# Altium schematic sheet PMU.SchDoc
size A4
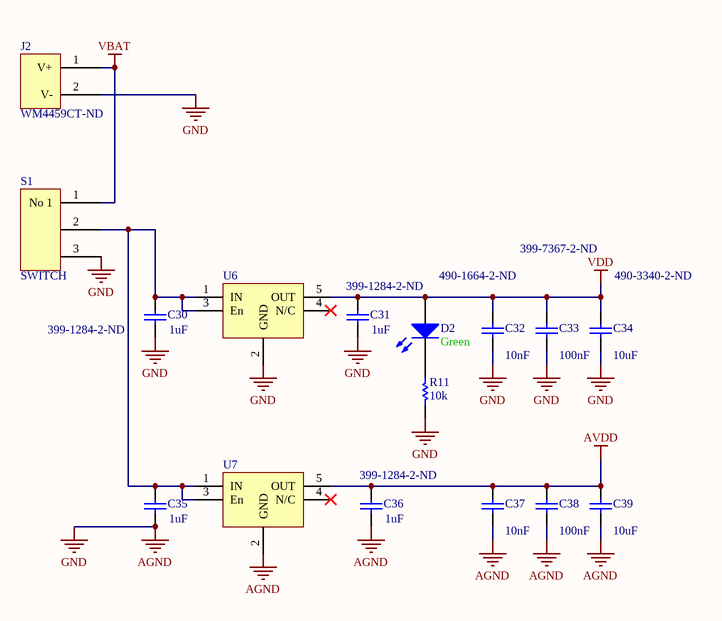
[diagram p0: PMU.SchDoc]

## Parts
C30  value 1uF  Supplier Part Number 1: 399-1284-2-ND  [0402]  (hidden comment: Cap Semi)
C31  value 1uF  Supplier Part Number 1: 399-1284-2-ND  [0402]  (hidden comment: Cap Semi)
C32  value 10nF  Supplier Part Number 1: 490-1664-2-ND  [0402]  (hidden comment: Cap Semi)
C33  value 100nF  Supplier Part Number 1: 399-7367-2-ND  [0402]  (hidden comment: Cap Semi)
C34  value 10uF  Supplier Part Number 1: 490-3340-2-ND  [0402]  (hidden comment: Cap Semi)
C35  value 1uF  [0402]  (hidden comment: Cap Semi)
C36  value 1uF  Supplier Part Number 1: 399-1284-2-ND  [0402]  (hidden comment: Cap Semi)
C37  value 10nF  [0402]  (hidden comment: Cap Semi)
C38  value 100nF  [0402]  (hidden comment: Cap Semi)
C39  value 10uF  [0402]  (hidden comment: Cap Semi)
D2  Color: Green  [0402]
J2  WM4459CT-ND  [WM4459CT-ND]
R11  value 10k  [0402]
S1  SWITCH  [CUS-12B]
U6  Reg 3.3V  [TSOP-5ll]  (value not drawn)
U7  Reg 3.3V  [TSOP-5ll]  (value not drawn)

## Nets
AGND: C30.1 C31.1 C32.1 C33.1 C34.1 C35.1 C36.1 C37.1 C38.1 C39.1 J2.2(V-) R11.2 S1.3 U6.2(GND) U7.2(GND)  [also labelled GND]
AVDD: C36.2 C37.2 C38.2 C39.2 U7.5(OUT)
VBAT: J2.1(V+) S1.1(No_1)
VDD: C31.2 C32.2 C33.2 C34.2 D2.1(A) U6.5(OUT)
NetC30_2: C30.2 C35.2 S1.2 U6.1(IN) U6.3(En) U7.1(IN) U7.3(En)
NetD2_2: D2.2(K) R11.1

Not connected (* = marked no-connect by the designer): U6 4(N/C)*; U7 4(N/C)*

## Library data of the parts
C30-C39 = Cap Semi: Capacitor (Semiconductor SIM Model); Published: 8-Jun-2000; LatestRevisionDate: 29-May-2009; LatestRevisionNote: IPC-7351 Footprint Added.; PackageReference: C1206; Publisher: Altium Limited; PackageDescription: Chip Capacitor; Supplier 1: Digi-Key
  C35: Supplier Part Number 1: 399-1284-2-ND
  C37: Supplier Part Number 1: 490-1664-2-ND
  C38: Supplier Part Number 1: 399-7367-2-ND
  C39: Supplier Part Number 1: 490-3340-2-ND
D2 = LED3: Typical BLUE SiC LED; Published: 8-Jun-2000; LatestRevisionDate: 17-Dec-2003; LatestRevisionNote: PCB Footprint replaced.; DatasheetVersion: 16-Apr-2002; PackageVersion: 16-Apr-2002; PackageReference: 3.5X2.8X1.9; Publisher: Altium Limited; PackageDescription: SM LED; 2 C-Bend Leads; Body 3.5 x 2.8 x 1.9 mm, inc leads (LxWxH typ)
R11 = Res Semi: Semiconductor Resistor; Published: 8-Jun-2000; LatestRevisionDate: 17-Jul-2002; LatestRevisionNote: Re-released for DXP Platform.; PackageReference: AXIAL-0.5; Publisher: Altium Limited; PackageDescription: Axial Device, Thru-Hole; 2 Leads; 0.5 in Pin Spacing
S1 = Component_1
U6 U7 = NCP603SN330T1G: IC REG LDO 3.3V 0.3A 5TSOP; Supplier 1: Digi-Key; Supplier Part Number 1: NCP603SN330T1GOSCT-ND